# EAGLE schematic PCB_Schematicfile (EAGLE 9.6.2)
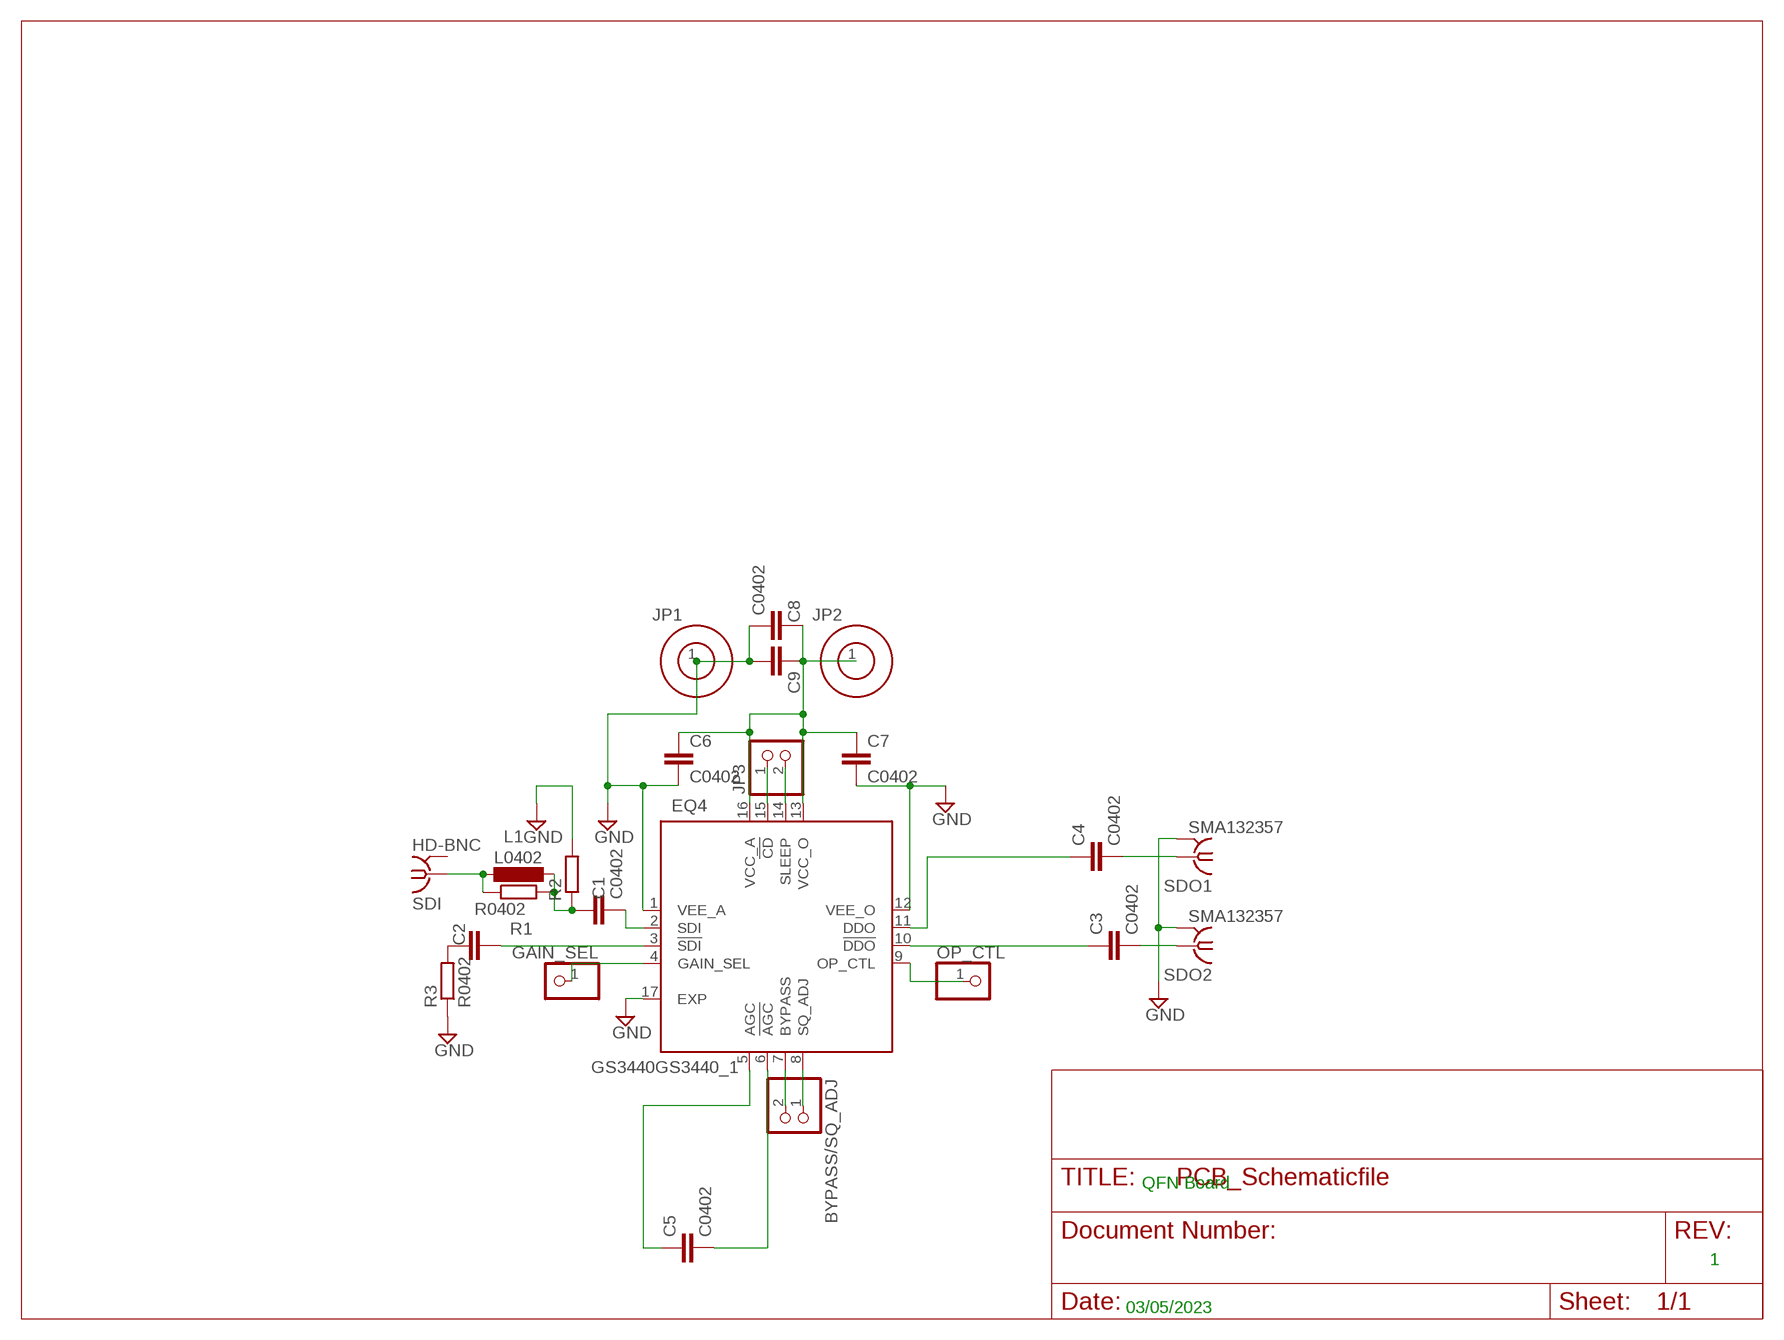
[diagram p0: schematic, sheet 1]

## Parts
BYPASS/SQ_ADJ  PINHD-1X2  [1X02]
C1  C0402  [0402]
C2  C0402  [0402]
C3  C0402  [0402]
C4  C0402  [0402]
C5  C0402  [0402]
C6  C0402  [0402]
C7  C0402  [0402]
C8  C0402  [0402]
C9  C-EUC0805  [C0805]
EQ4  GS3440GS3440_1  [QFN65P400X400X90-17T260N]
GAIN_SEL  PINHD-1X1  [1X01]
JP1  4MMSOCKET  [4MM]
JP2  4MMSOCKET  [4MM]
JP3  PINHD-1X2  [1X02]
L1  L0402  [0402]
OP_CTL  PINHD-1X1  [1X01]
R1  R0402  [0402]
R2  R0402  [0402]
R3  R0402  [0402]
SDI  HD-BNC  [034_1018_12G]
SDO1  SMA132357  [SMA]
SDO2  SMA132357  [SMA]

## Nets
33V: C6.1 C7.1 C8.1 C9.1 EQ4.13(VCC_O) EQ4.16(VCC_A) JP2.1
75OHM [75ohmtl]: C1.2 EQ4.2(SDI)
GND: C6.2 C7.2 C8.2 C9.2 EQ4.1(VEE_A) EQ4.12(VEE_O) EQ4.17(EXP) JP1.1 R2.2 R3.1 SDO1.G@1 SDO1.G@2 SDO1.G@3 SDO1.G@4 SDO2.G@1 SDO2.G@2 SDO2.G@3 SDO2.G@4
N$1: C5.2 EQ4.6(!AGC)
N$2: C1.1 L1.2 R1.2 R2.1
N$3: C3.1 EQ4.10(!DDO)
N$4: C2.2 EQ4.3(!SDI)
N$5: EQ4.4(GAIN_SEL) GAIN_SEL.1
N$6: C2.1 R3.2
N$7: EQ4.15(!CD) JP3.1
N$9: C4.1 EQ4.11(DDO)
N$10 [50ohmtl]: C4.2 SDO1.1
N$11: EQ4.14(SLEEP) JP3.2
N$12: C5.1 EQ4.5(AGC)
N$14 [50ohmtl]: C3.2 SDO2.1
N$15 [75ohmtl]: L1.1 R1.1 SDI.P$1
N$16: BYPASS/SQ_ADJ.2 EQ4.7(BYPASS)
N$17: BYPASS/SQ_ADJ.1 EQ4.8(SQ_ADJ)
N$18: EQ4.9(OP_CTL) OP_CTL.1
Unconnected: SDI.G@1 SDI.G@2 SDI.G@3 SDI.G@4

## Notes on the sheet
- QFN Board
- 1
- 03/05/2023

## Library data of the parts
BYPASS/SQ_ADJ JP3 = pinhead:PINHD-1X2: PIN HEADER
C1-C8 = labHDE_rev3:C0402
C9 = rcl:C-EU: CAPACITOR, European symbol; SPICEPREFIX: C
EQ4 = labHDE_rev3:GS3440: Adaptive Cable Equalizer
GAIN_SEL OP_CTL = pinhead:PINHD-1X1: PIN HEADER
JP1 JP2 = labHDE_rev3:4MMSOCKET: 4MM SOCKET
L1 = labHDE_rev3:L0402
R1-R3 = labHDE_rev3:R0402
SDI = labHDE_rev3:HD-BNC: HD BNC 75 Ohm AMPHENOL RF
SDO1 SDO2 = labHDE_rev3:SMA: SMA 50 Ohm End Launch Jack Receptacle - Round Contact AMPHENOL RF

## Net classes
1 50ohmtl: width 0.723 mm
2 75ohmtl: width 0.344 mm